# EAGLE schematic ECG (EAGLE 9.2.2)

## Sheet 1 of 2
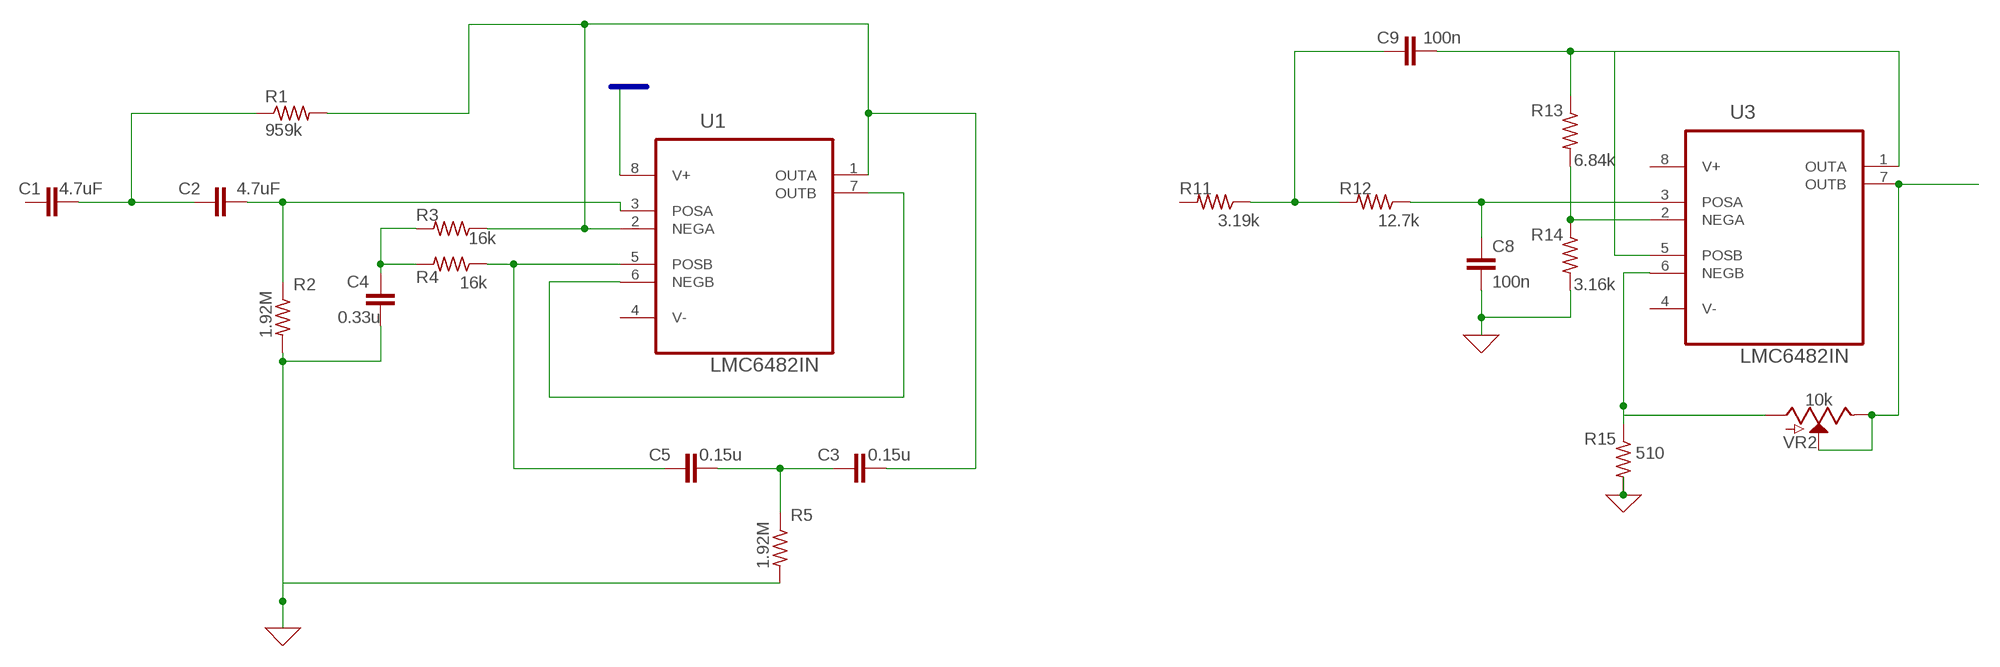
[diagram p0: schematic, sheet 1]

### Parts
C1  4.7uF  4.7UF-0603-6.3V-(10%)  [0603]
C2  4.7uF  4.7UF-0603-6.3V-(10%)  [0603]
C3  0.15u  C-EU075-042X103  [C075-042X103]
C4  0.33u  C-EU075-042X103  [C075-042X103]
C5  0.15u  C-EU075-042X103  [C075-042X103]
C8  100n  C-EU025-025X050  [C025-025X050]
C9  100n  C-EU025-025X050  [C025-025X050]
R1  959k  R-US_R0805  [R0805]
R2  1.92M  R-US_R0805  [R0805]
R3  16k  R-US_R0805  [R0805]
R4  16k  R-US_R0805  [R0805]
R5  1.92M  R-US_R0805  [R0805]
R11  3.19k  R-US_R0805  [R0805]
R12  12.7k  R-US_R0805  [R0805]
R13  6.84k  R-US_R0805  [R0805]
R14  3.16k  R-US_R0805  [R0805]
R15  510  R-US_R0805  [R0805]
U1  LMC6482IN  [DIP254P762X508-8]
U3  LMC6482IN  [DIP254P762X508-8]
VR2  10k  POTENTIOMETER_SLIDE-20MM-1/10W-20%  [SLIDER-SMALL]

### Nets
0: C4.2 C8.2 R2.2 R5.2 R14.2 R15.2 ; supply symbol labelled GND
B$3: U1.8(V+)
N$1: C1.2 C2.1 R1.1
N$2: C2.2 R2.1 U1.3(POSA)
N$3: C3.2 R1.2 R3.1 U1.1(OUTA) U1.2(NEGA)
N$4: C4.1 R3.2 R4.2
N$5: C5.1 R4.1 U1.5(POSB)
N$6: U1.6(NEGB) U1.7(OUTB)
N$7: C3.1 C5.2 R5.1
N$14: C8.1 R12.1 U3.3(POSA)
N$15: C9.1 R11.1 R12.2
N$16: C9.2 R13.1 U3.1(OUTA) U3.5(POSB)
N$17: R13.2 R14.1 U3.2(NEGA)
N$18: R15.1 U3.6(NEGB) VR2.BOTTOM(A)
N$19: U3.7(OUTB) VR2.TOP(E) VR2.WIPER(S)
Unconnected: C1.1 R11.2

### Buses
B$3

## Sheet 2 of 2
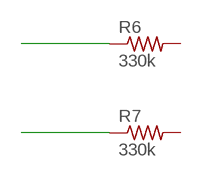
[diagram p1: schematic, sheet 2]

### Parts
R6  330k  R-US_R0805  [R0805]
R7  330k  R-US_R0805  [R0805]

### Nets
N$8: R7.1
N$9: R6.1
Unconnected: R6.2 R7.2

## Power pins joined to a net without a drawn wire
V+: U3.8(V+)
V-: U1.4(V-) U3.4(V-)

## Library data of the parts
C1 C2 = SparkFun-Capacitors:4.7UF: 4.7µF ceramic capacitors A capacitor is a passive two-terminal electrical component used to store electrical energy temporarily in an electric field.; PROD_ID: CAP-08280
C3-C5 C8 C9 = rcl:C-EU: CAPACITOR, European symbol; SPICEPREFIX: C
R1-R7 R11-R15 = rcl:R-US_: RESISTOR, American symbol; SPICEPREFIX: R
U1 U3 = LMC6482IN:LMC6482IN: OP Amps; AVAILABILITY: Unavailable; DESCRIPTION: CMOS Dual Rail-to-Rail Input and Output Operational Amplifier 8-PDIP -40 to 85; MF: Texas Instruments; MP: LMC6482IN/NOPB; PACKAGE: DIP-8 Texas Instruments; PRICE: None
VR2 = SparkFun-Resistors:POTENTIOMETER_SLIDE: Slide Potentiometer Slide-type potentiometers - pots that are adjusted by sliding a wiper up or down. Commonly found en-masse on sound boards. Variants 60MM - Slide Pot - X-Large (10k Linear Taper) <https://www.sparkfun.com/products/9119> (COM-09119) 10k linear slide pot with 60mm travel. Datasheet <http://cdn.sparkfun.com/datasheets/Components/Switches/SC608N-b10k.pdf> 30MM, 30MM-KIT - Slide Pot - Medium (10k Linear Taper) <https://www.sparkfun.com/products/11621> (COM-11621) 10k linear slide pot with 30mm travel. Datasheet <http://cdn.sparkfun.com/datasheets/Components/Switches/C-31-.pdf> (C3031N-1A2-B10K-GP) "KIT" variant, intended for soldering kits, has tStop removed from pads so the component can only be stuffed on one side of the board. 20MM - Slide Pot - Small (10k Linear Taper) <https://www.sparkfun.com/products/11620> (COM-11620) 10k linear slide pot with 20mm travel. Datasheet <http://cdn.sparkfun.com/datasheets/Components/Switches/C-31-.pdf> (C2031N-1A2-B10K-GP); PROD_ID: RES-11924; SF_SKU: COM-11620